# Altium schematic sheet Edge_Detection.SchDoc
size B; DocumentNumber: 1; SheetNumber: 1; SheetTotal: 1
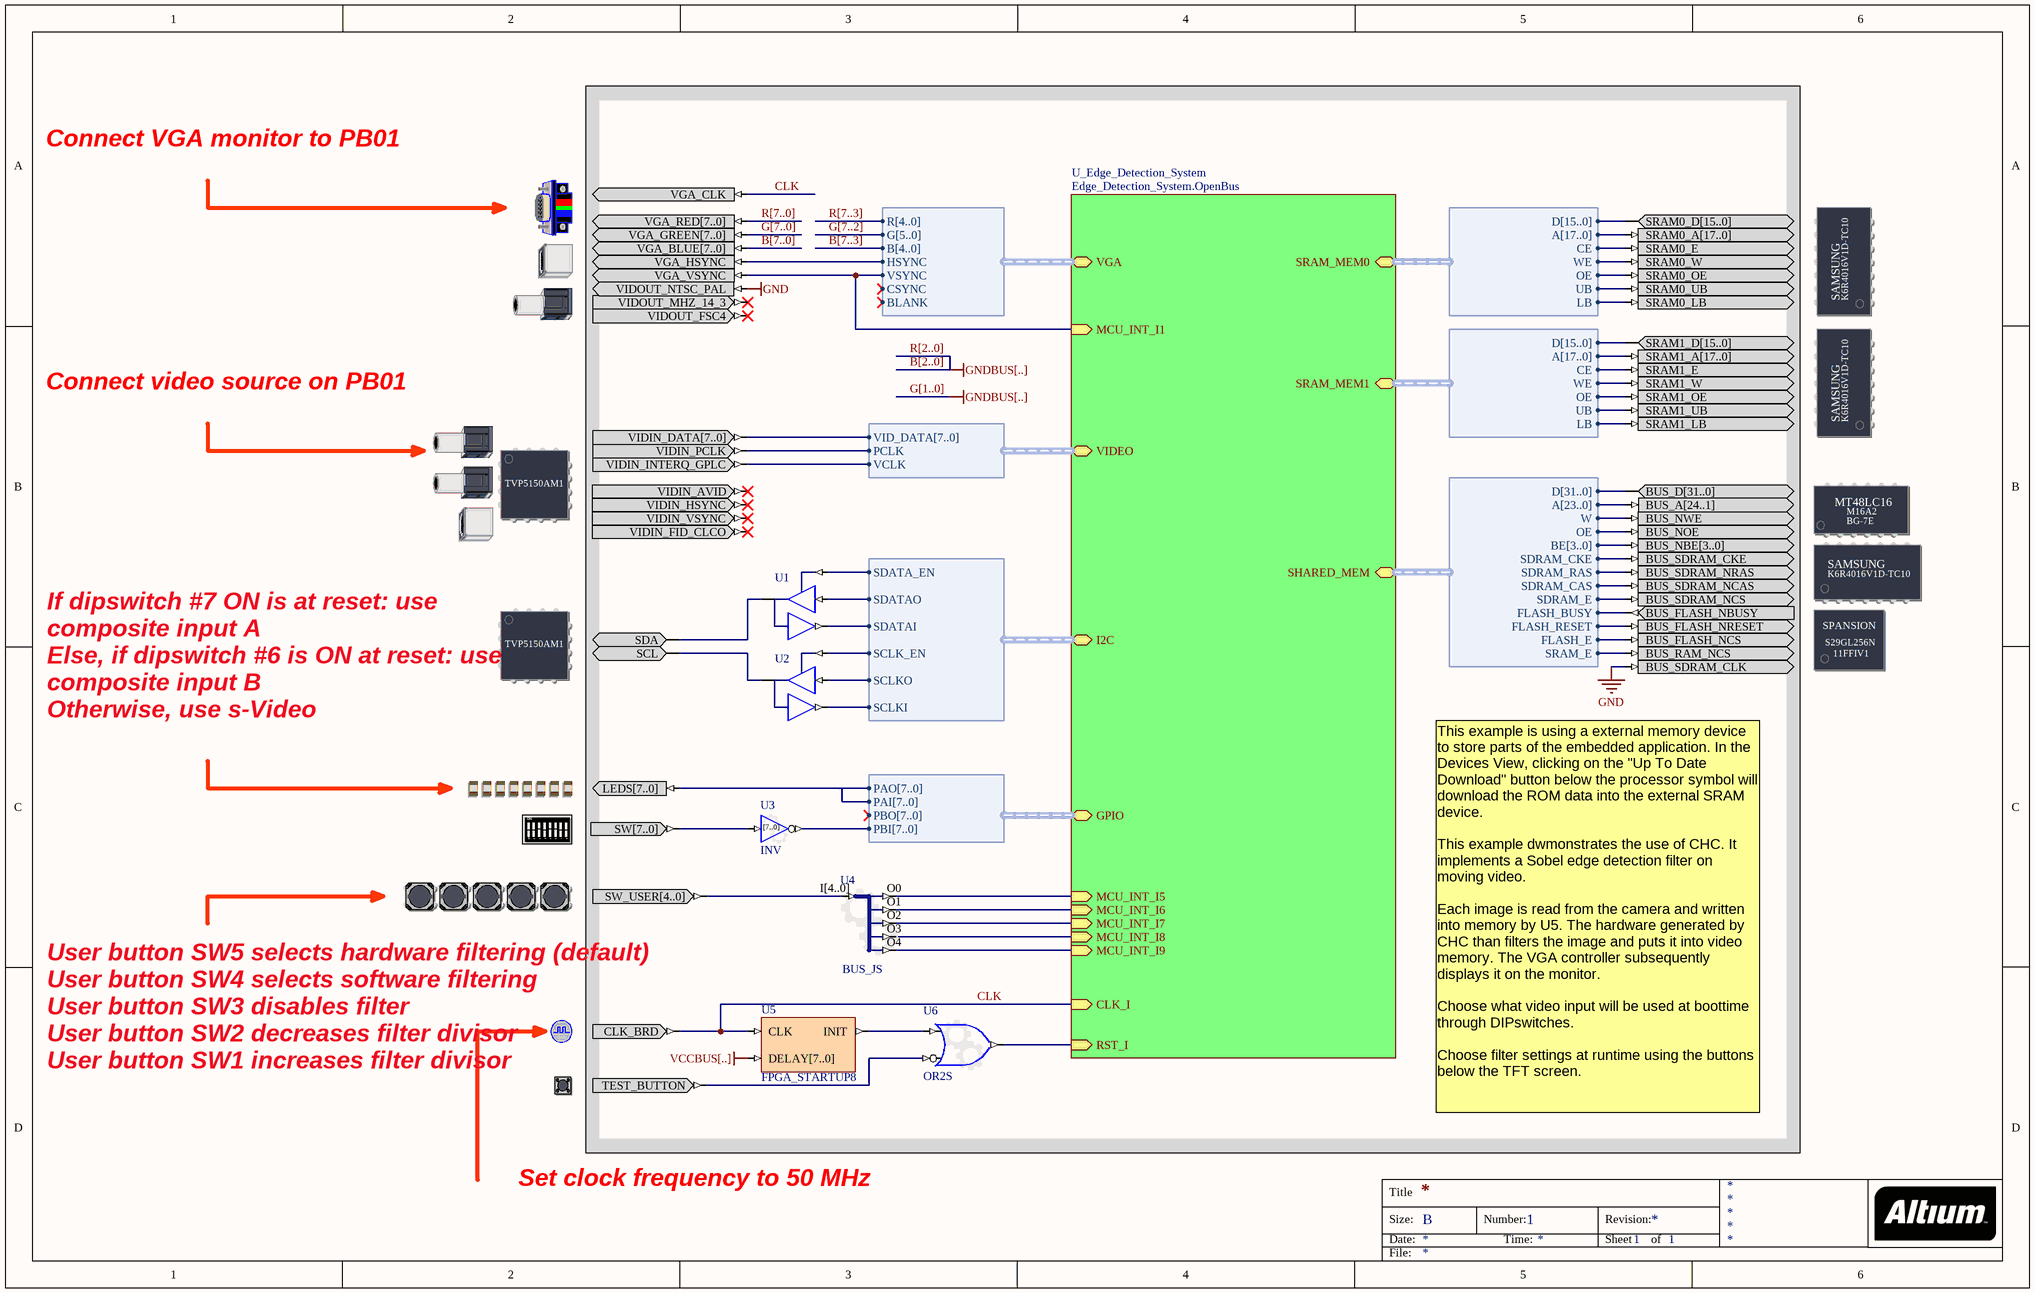
[diagram p0: Edge_Detection.SchDoc]

## Parts
(Parts that share a designator on the sheet are numbered #1, #2 ... from top to bottom, then left to right.)
?#1  VIDEO_OUTPUT  (value not drawn)
?#2  SRAM_DAUGHTER0  (value not drawn)
?#3  SRAM_DAUGHTER1  (value not drawn)
?#4  VIDEO_INPUT  (value not drawn)
?#5  SHARED_MEM_DAUGHTER  (value not drawn)
?#6  VIDEO_INPUT_CTRL  (value not drawn)
?#7  LED  (value not drawn)
?#8  DIPSWITCH  (value not drawn)
?#9  USER_BUTTONS  (value not drawn)
?#10  CLOCK_BOARD  (value not drawn)
?#11  TEST_BUTTON  (value not drawn)
U1  IOBUF  (value not drawn)
U2  IOBUF  (value not drawn)
U3  INV
U4  BUS_JS
U5  FPGA_STARTUP8
U6  OR2S

## Sub-sheets
U_Edge_Detection_System = Edge_Detection_System.OpenBus: MCU_INT_I5 (in), MCU_INT_I6 (in), MCU_INT_I7 (in), MCU_INT_I8 (in), MCU_INT_I9 (in), RST_I (in), CLK_I (in), MCU_INT_I1 (in), GPIO (harness WB_PRTIO_IO_2_2), SRAM_MEM0 (harness WB_MEM_CTRL_SRAM16_A18), SRAM_MEM1 (harness WB_MEM_CTRL_SRAM16_A18), I2C (harness WB_I2CM), VIDEO (harness BT656), SHARED_MEM (harness WB_SHARED_MEM_CTRL), VGA (harness VGA32_16BPP)

## Harnesses
WB_MEM_CTRL_SRAM16_A18: D[15..0], A[17..0], CE, WE, OE, UB, LB
BT656: VID_DATA[7..0], PCLK, VCLK
WB_I2CM: SDATA_EN, SDATAO, SDATAI, SCLK_EN, SCLKO, SCLKI
VGA32_16BPP: R[4..0], G[5..0], B[4..0], HSYNC, VSYNC, CSYNC, BLANK
WB_PRTIO_IO_2_2: PAO[7..0], PAI[7..0], PBO[7..0], PBI[7..0]
WB_SHARED_MEM_CTRL: D[31..0], A[23..0], W, OE, BE[3..0], SDRAM_CKE, SDRAM_RAS, SDRAM_CAS, SDRAM_E, FLASH_BUSY, FLASH_RESET, FLASH_E, SRAM_E

## Nets
GND: ?#1.VIDOUT_NTSC_PAL ?#5.BUS_SDRAM_CLK
VCCBUS[..]: U5.DELAY[7..0]
B[7..0]: ?#1.VGA_BLUE[7..0]
CLK: ?#1.VGA_CLK ?#10.CLK_BRD U5.CLK ; sheet U_Edge_Detection_System/CLK_I
G[7..0]: ?#1.VGA_GREEN[7..0]
R[7..0]: ?#1.VGA_RED[7..0]
Net?#1_VGA_HSYNC: ?#1.VGA_HSYNC ; sheet U_Edge_Detection_System/VGA.HSYNC
Net?#1_VGA_VSYNC: ?#1.VGA_VSYNC ; sheet U_Edge_Detection_System/MCU_INT_I1, sheet U_Edge_Detection_System/VGA.VSYNC
Net?#2_SRAM0_A[17..0]: ?#2.SRAM0_A[17..0] ; sheet U_Edge_Detection_System/SRAM_MEM0.A[17..0]
Net?#2_SRAM0_D[15..0]: ?#2.SRAM0_D[15..0] ; sheet U_Edge_Detection_System/SRAM_MEM0.D[15..0]
Net?#2_SRAM0_E: ?#2.SRAM0_E ; sheet U_Edge_Detection_System/SRAM_MEM0.CE
Net?#2_SRAM0_LB: ?#2.SRAM0_LB ; sheet U_Edge_Detection_System/SRAM_MEM0.LB
Net?#2_SRAM0_OE: ?#2.SRAM0_OE ; sheet U_Edge_Detection_System/SRAM_MEM0.OE
Net?#2_SRAM0_UB: ?#2.SRAM0_UB ; sheet U_Edge_Detection_System/SRAM_MEM0.UB
Net?#2_SRAM0_W: ?#2.SRAM0_W ; sheet U_Edge_Detection_System/SRAM_MEM0.WE
Net?#3_SRAM1_A[17..0]: ?#3.SRAM1_A[17..0] ; sheet U_Edge_Detection_System/SRAM_MEM1.A[17..0]
Net?#3_SRAM1_D[15..0]: ?#3.SRAM1_D[15..0] ; sheet U_Edge_Detection_System/SRAM_MEM1.D[15..0]
Net?#3_SRAM1_E: ?#3.SRAM1_E ; sheet U_Edge_Detection_System/SRAM_MEM1.CE
Net?#3_SRAM1_LB: ?#3.SRAM1_LB ; sheet U_Edge_Detection_System/SRAM_MEM1.LB
Net?#3_SRAM1_OE: ?#3.SRAM1_OE ; sheet U_Edge_Detection_System/SRAM_MEM1.OE
Net?#3_SRAM1_UB: ?#3.SRAM1_UB ; sheet U_Edge_Detection_System/SRAM_MEM1.UB
Net?#3_SRAM1_W: ?#3.SRAM1_W ; sheet U_Edge_Detection_System/SRAM_MEM1.WE
Net?#4_VIDIN_DATA[7..0]: ?#4.VIDIN_DATA[7..0] ; sheet U_Edge_Detection_System/VIDEO.VID_DATA[7..0]
Net?#4_VIDIN_INTERQ_GPLC: ?#4.VIDIN_INTERQ_GPLC ; sheet U_Edge_Detection_System/VIDEO.VCLK
Net?#4_VIDIN_PCLK: ?#4.VIDIN_PCLK ; sheet U_Edge_Detection_System/VIDEO.PCLK
Net?#5_BUS_A[24..1]: ?#5.BUS_A[24..1] ; sheet U_Edge_Detection_System/SHARED_MEM.A[23..0]
Net?#5_BUS_D[31..0]: ?#5.BUS_D[31..0] ; sheet U_Edge_Detection_System/SHARED_MEM.D[31..0]
Net?#5_BUS_FLASH_NBUSY: ?#5.BUS_FLASH_NBUSY ; sheet U_Edge_Detection_System/SHARED_MEM.FLASH_BUSY
Net?#5_BUS_FLASH_NCS: ?#5.BUS_FLASH_NCS ; sheet U_Edge_Detection_System/SHARED_MEM.FLASH_E
Net?#5_BUS_FLASH_NRESET: ?#5.BUS_FLASH_NRESET ; sheet U_Edge_Detection_System/SHARED_MEM.FLASH_RESET
Net?#5_BUS_NBE[3..0]: ?#5.BUS_NBE[3..0] ; sheet U_Edge_Detection_System/SHARED_MEM.BE[3..0]
Net?#5_BUS_NOE: ?#5.BUS_NOE ; sheet U_Edge_Detection_System/SHARED_MEM.OE
Net?#5_BUS_NWE: ?#5.BUS_NWE ; sheet U_Edge_Detection_System/SHARED_MEM.W
Net?#5_BUS_RAM_NCS: ?#5.BUS_RAM_NCS ; sheet U_Edge_Detection_System/SHARED_MEM.SRAM_E
Net?#5_BUS_SDRAM_CKE: ?#5.BUS_SDRAM_CKE ; sheet U_Edge_Detection_System/SHARED_MEM.SDRAM_CKE
Net?#5_BUS_SDRAM_NCAS: ?#5.BUS_SDRAM_NCAS ; sheet U_Edge_Detection_System/SHARED_MEM.SDRAM_CAS
Net?#5_BUS_SDRAM_NCS: ?#5.BUS_SDRAM_NCS ; sheet U_Edge_Detection_System/SHARED_MEM.SDRAM_E
Net?#5_BUS_SDRAM_NRAS: ?#5.BUS_SDRAM_NRAS ; sheet U_Edge_Detection_System/SHARED_MEM.SDRAM_RAS
Net?#6_SCL: ?#6.SCL U2.IO
Net?#6_SDA: ?#6.SDA U1.IO
Net?#7_LEDS[7..0]: ?#7.LEDS[7..0] ; sheet U_Edge_Detection_System/GPIO.PAO[7..0], sheet U_Edge_Detection_System/GPIO.PAI[7..0]
Net?#8_SW[7..0]: ?#8.SW[7..0] U3.I[7..0]
Net?#9_SW_USER[4..0]: ?#9.SW_USER[4..0] U4.I[4..0]
Net?#11_TEST_BUTTON: ?#11.TEST_BUTTON U6.I1
NetU1_I: U1.I ; sheet U_Edge_Detection_System/I2C.SDATAO
NetU1_O: U1.O ; sheet U_Edge_Detection_System/I2C.SDATAI
NetU1_T: U1.T ; sheet U_Edge_Detection_System/I2C.SDATA_EN
NetU2_I: U2.I ; sheet U_Edge_Detection_System/I2C.SCLKO
NetU2_O: U2.O ; sheet U_Edge_Detection_System/I2C.SCLKI
NetU2_T: U2.T ; sheet U_Edge_Detection_System/I2C.SCLK_EN
NetU3_O[7..0]: U3.O[7..0] ; sheet U_Edge_Detection_System/GPIO.PBI[7..0]
NetU4_O0: U4.O0 ; sheet U_Edge_Detection_System/MCU_INT_I5
NetU4_O1: U4.O1 ; sheet U_Edge_Detection_System/MCU_INT_I6
NetU4_O2: U4.O2 ; sheet U_Edge_Detection_System/MCU_INT_I7
NetU4_O3: U4.O3 ; sheet U_Edge_Detection_System/MCU_INT_I8
NetU4_O4: U4.O4 ; sheet U_Edge_Detection_System/MCU_INT_I9
NetU5_INIT: U5.INIT U6.I0
NetU6_O: U6.O ; sheet U_Edge_Detection_System/RST_I

Not connected (* = marked no-connect by the designer): ?#1 VIDOUT_FSC4* VIDOUT_MHZ_14_3*; ?#4 VIDIN_AVID* VIDIN_FID_CLCO* VIDIN_HSYNC* VIDIN_VSYNC*

## Buses and harness runs
bus B[2..0] = R[2..0]
bus B[7..0]
bus B[7..3]
bus G[1..0]
bus G[7..0]
bus G[7..2]
bus R[7..0]
bus R[7..3]

## Notes on the sheet
- Connect VGA monitor to PB01
- Connect video source on PB01
- If dipswitch #7 ON is at reset: use composite input A
  Else, if dipswitch #6 is ON at reset: use composite input B
  Otherwise, use s-Video
- This example is using a external memory device to store parts of the embedded application. In the Devices View, clicking on the "Up To Date Download" button below the processor symbol will download the ROM data into the external SRAM device.
  This example dwmonstrates the use of CHC. It implements a Sobel edge detection filter on moving video.
  Each image is read from the camera and written into memory by U5. The hardware generated by CHC than filters the image and puts it into video memory. The VGA controller subsequently displays it on the monitor.
  Choose what video input will be used at boottime through DIPswitches.
  Choose filter settings at runtime using the buttons below the TFT screen.
- User button SW5 selects hardware filtering (default)
  User button SW4 selects software filtering
  User button SW3 disables filter
  User button SW2 decreases filter divisor
  User button SW1 increases filter divisor
- Set clock frequency to 50 MHz
- Title
- Size:
- Date:
- B
- Number:
- Time:
- Revision:
- Sheet
- of
- File:
- (in symbol DIPSWITCH) ON; 1; 2; 3; 4; 5; 6; 7; 8
- (in symbol INV) [7..0]
- (in symbol SHARED_MEM_DAUGHTER) MT48LC16; M16A2; BG-7E; SAMSUNG; K6R4016V1D-TC10; SPANSION; S29GL256N; 11FFIV1
- (in symbol SRAM_DAUGHTER0) SAMSUNG; K6R4016V1D-TC10
- (in symbol SRAM_DAUGHTER1) SAMSUNG; K6R4016V1D-TC10
- (in symbol VIDEO_INPUT) TVP5150AM1
- (in symbol VIDEO_INPUT_CTRL) TVP5150AM1

## Library data of the parts
?#1 = VIDEO_OUTPUT: Video Outputs; PortComponent: True; Published: 22-Jan-2007; Publisher: Altium Limited; HelpURL: TR0145 Technical Reference for Altium's Audio-Video Peripheral Board PB01.pdf#page=10
?#2 = SRAM_DAUGHTER0: Free Static RAM - Daughterboard; PortComponent: True; Published: 14-May-2007; Publisher: Altium Limited; HelpURL: TR0149 Technical Reference for Altium's Xilinx Spartan-3 Daughter Board DB30.pdf#page=16
?#3 = SRAM_DAUGHTER1: Free Static RAM - Daughterboard; PortComponent: True; Published: 14-May-2007; Publisher: Altium Limited; HelpURL: TR0149 Technical Reference for Altium's Xilinx Spartan-3 Daughter Board DB30.pdf#page=16
?#4 = VIDEO_INPUT: Video Inputs; PortComponent: True; Published: 22-Jan-2007; Publisher: Altium Limited; HelpURL: TR0145 Technical Reference for Altium's Audio-Video Peripheral Board PB01.pdf#page=7
?#5 = SHARED_MEM_DAUGHTER: Shared Memory - Daughterboard; PortComponent: True; Published: 14-May-2007; Publisher: Altium Limited; HelpURL: TR0149 Technical Reference for Altium's Xilinx Spartan-3 Daughter Board DB30.pdf#page=15
?#6 = VIDEO_INPUT_CTRL: Video Input Control; PortComponent: True; Published: 22-Jan-2007; Publisher: Altium Limited; HelpURL: TR0145 Technical Reference for Altium's Audio-Video Peripheral Board PB01.pdf#page=8
?#7 = LED: Bank of eight Red LEDs; PortComponent: True; Published: 19-Nov-2003; Publisher: Altium Limited; HelpURL: TR0143 Technical Reference Manual for Altium's Desktop NanoBoard NB2DSK01.pdf#page=51
?#8 = DIPSWITCH: 8-Way Dip-Switch; PortComponent: True; Published: 19-Nov-2003; Publisher: Altium Limited; HelpURL: TR0143 Technical Reference Manual for Altium's Desktop NanoBoard NB2DSK01.pdf#page=51
?#9 = USER_BUTTONS: Generic User Buttons; PortComponent: True; Published: 16-Apr-2007; Publisher: Altium Limited; HelpURL: TR0143 Technical Reference Manual for Altium's Desktop NanoBoard NB2DSK01.pdf#page=53
?#10 = CLOCK_BOARD: Global System Clock Supply; PortComponent: True; Published: 19-Nov-2003; Publisher: Altium Limited; HelpURL: TR0143 Technical Reference Manual for Altium's Desktop NanoBoard NB2DSK01.pdf#page=41; UseInDSF: True
?#11 = TEST_BUTTON: Test / Reset Button; PortComponent: True; Published: 19-Nov-2003; Publisher: Altium Limited; HelpURL: TR0143 Technical Reference Manual for Altium's Desktop NanoBoard NB2DSK01.pdf#page=53
U1 U2 = IOBUF: Input/Output Buffer; Enable: Low; Control: Common Control T; ArchiveName: GENERIC; VHDLIB_SIM: GENERIC_LIB; Published: 29-Jan-2004; Publisher: Altium Limited; XilinxEquivalent: IOBUF; LastRevisionNo: 1.00.00; HelpURL: CR0118 FPGA Generic Library Guide.pdf#page=292; ComponentLink1URL: CR0125 FPGA Buffer Resource Usage.pdf#page=78; ComponentLink1Description: Core &Resource Usage; FunctionalClass: Buffer; SubClass: IOBUF
U3 = INV: Configurable Inverter; ConfigurationParameters: {}Version[1.0]{}SignalCount[1]{}SignalWidth0[8]{}OutputOption0[Inverted]{}EnableMode[None]{}ShowPinNames[False]{}; ConfiguratorName: GENERIC_BUFFER; LastRevisionNo: 1.00.00; Published: 10-Oct-2008; Publisher: Altium Limited
U4 = BUS_JS: Configurable Bus Joiner/Splitter; ConfiguratorName: GENERIC_BUS_JS; ConfigurationParameters: {}Version[1.0]{}SplitterJoinerType[Splitter]{}SignalCount[5]{}SignalWidth0[1]{}SignalWidth1[1]{}SignalWidth2[1]{}SignalWidth3[1]{}SignalWidth4[1]{}; LastRevisionNo: 1.00.00; Published: 17-Sep-2008; Publisher: Altium Limited
U5 = FPGA_STARTUP8: FPGA Startup With 8 Bit Delay; Published: 9-Dec-2004; Publisher: Altium Limited; HelpURL: CR0119 FPGA_STARTUPx Powerup Delay Unit.pdf; LastRevisionNo: 1.00.00; ComponentLink1Description: Core &Resource Usage; ComponentLink1URL: CR0139 FPGA Peripheral Resource Usage.pdf#page=11
U6 = GATE: Configurable Generic Gate; ConfiguratorName: GENERIC_GATE; ConfigurationParameters: {}Version[1.0]{}GateKind[OR]{}BusInput[False]{}GateInputType[Bit]{}GateOutputOption[Normal]{}BusWidth[8]{}RegisterOutputs[False]{}NegativeClockEdge[False]{}InputCount[2]{}InputInvert0[False]{}InputInvert1[True]{}; LastRevisionNo: 1.00.00; Published: 3-Sep-2008; Publisher: Altium Limited